# Altium schematic sheet 03 POWER TREE.SchDoc
size 420 x 297 mm; Organization: Altium Limited; Address1: L3, 12a Rodborough Rd; Address2: Frenchs Forest; Address3: NSW; Address4: Australia 2086
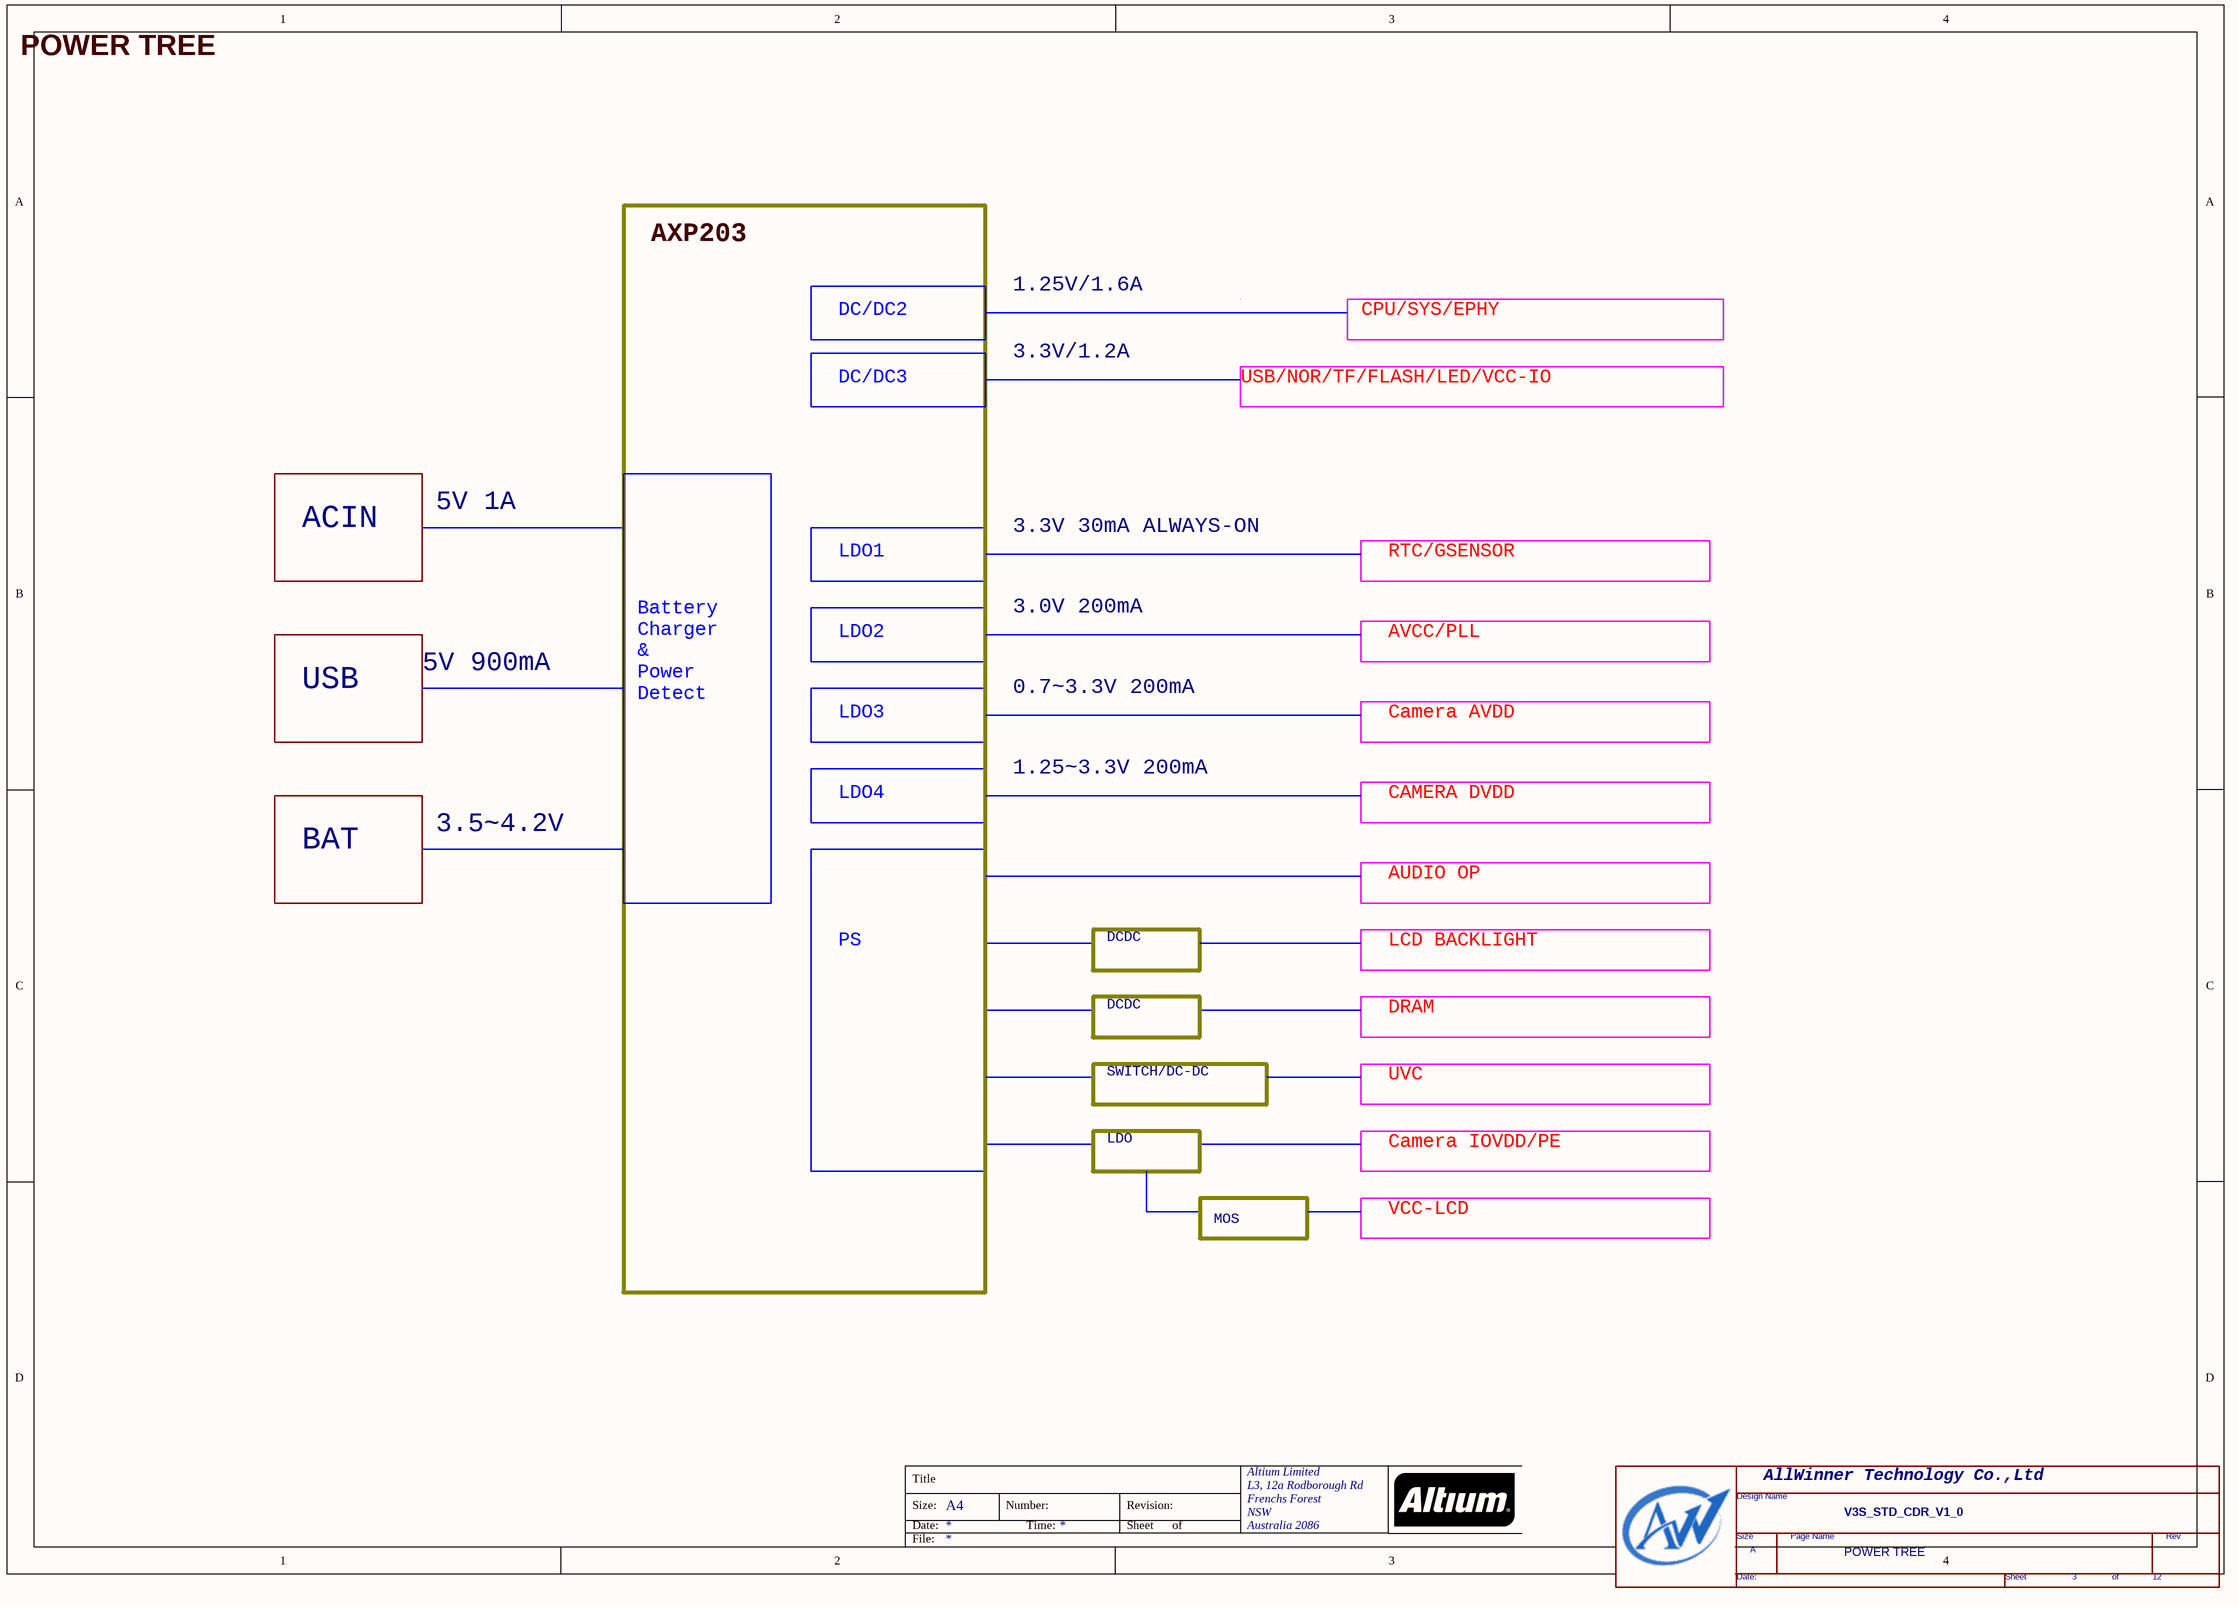
[diagram p0: 03 POWER TREE.SchDoc]

## Parts
*  Page Count: 12  Page Number: 3  Page Size: A  Title: V3S_STD_CDR_V1_0  Doc: POWER TREE  (hidden comment: TitleBlock0-AW)  (graphical)

## Notes on the sheet
- POWER TREE
- AXP203
- DC/DC2
- 1.25V/1.6A
- CPU/SYS/EPHY
- DC/DC3
- 3.3V/1.2A
- USB/NOR/TF/FLASH/LED/VCC-IO
- 5V 1A
- ACIN
- Battery
  Charger
  &
  Power
  Detect
- LDO1
- 3.3V 30mA ALWAYS-ON
- RTC/GSENSOR
- LDO2
- 3.0V 200mA
- AVCC/PLL
- USB
- 5V 900mA
- LDO3
- 0.7~3.3V 200mA
- Camera AVDD
- 1.25~3.3V 200mA
- BAT
- 3.5~4.2V
- LDO4
- CAMERA DVDD
- AUDIO OP
- PS
- DCDC
- LCD BACKLIGHT
- DRAM
- SWITCH/DC-DC
- UVC
- LDO
- Camera IOVDD/PE
- MOS
- VCC-LCD
- Title
- Size:
- Date:
- A4
- Number:
- Time:
- Revision:
- Sheet
- of
- File:
- (in symbol TitleBlock0-AW) AllWinner Technology Co.,Ltd; Design Name; Size; Page Name; Rev; Date:; Sheet; of

## Library data of the parts
* = TitleBlock0-AW: Page Create Date: March  8, 1995